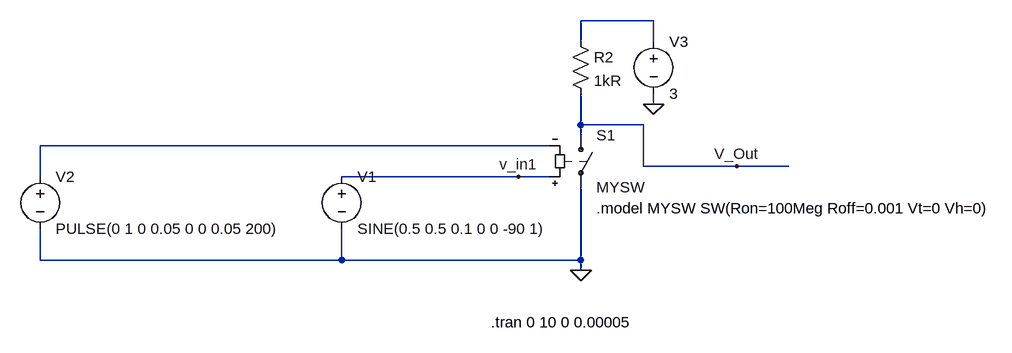
[diagram p0: schematic PWM_Source.asc]
PWM_Source.asc, the LTspice schematic file:
Version 4
SHEET 1 880 680
WIRE 288 -80 176 -80
WIRE 176 -48 176 -80
WIRE 288 -48 288 -80
WIRE 288 48 288 32
WIRE 176 80 176 32
WIRE 272 80 176 80
WIRE 176 96 176 80
WIRE 128 112 -656 112
WIRE 272 144 272 80
WIRE 416 144 272 144
WIRE 496 144 416 144
WIRE -656 160 -656 112
WIRE 80 160 -192 160
WIRE 128 160 80 160
WIRE -656 288 -656 240
WIRE -192 288 -192 240
WIRE -192 288 -656 288
WIRE 176 288 176 176
WIRE 176 288 -192 288
WIRE 176 304 176 288
FLAG 176 304 0
FLAG 288 48 0
FLAG 416 144 V_Out
FLAG 80 160 v_in1
SYMBOL voltage -192 144 R0
WINDOW 123 0 0 Left 0
WINDOW 39 0 0 Left 0
SYMATTR InstName V1
SYMATTR Value SINE(0.5 0.5 0.1 0 0 -90 1)
SYMBOL voltage -656 144 R0
WINDOW 123 0 0 Left 0
WINDOW 39 0 0 Left 0
SYMATTR InstName V2
SYMATTR Value PULSE(0 1 0 0.05 0 0 0.05 200)
SYMBOL voltage 288 -64 R0
WINDOW 123 0 0 Left 0
WINDOW 39 0 0 Left 0
SYMATTR InstName V3
SYMATTR Value 3
SYMBOL sw 176 80 R0
SYMATTR InstName S1
SYMATTR Value MYSW
SYMBOL res 160 -64 R0
SYMATTR InstName R2
SYMATTR Value 1kR
TEXT 38 384 Left 2 !.tran 0 10 0 0.00005
TEXT 200 208 Left 2 !.model MYSW SW(Ron=100Meg Roff=0.001 Vt=0 Vh=0)

The netlist it stands for:
* PWM_Source.asc
V1 v_in1 0 SINE(0.5 0.5 0.1 0 0 -90 1)
V2 N002 0 PULSE(0 1 0 0.05 0 0 0.05 200)
V3 N001 0 3
S1 V_Out 0 v_in1 N002 MYSW
R2 N001 V_Out 1kR
.tran 0 10 0 0.00005
.model MYSW SW(Ron=100Meg Roff=0.001 Vt=0 Vh=0)
.backanno
.end